# Altium schematic sheet Power.SchDoc
size A4; SheetNumber: 5; SheetTotal: 5
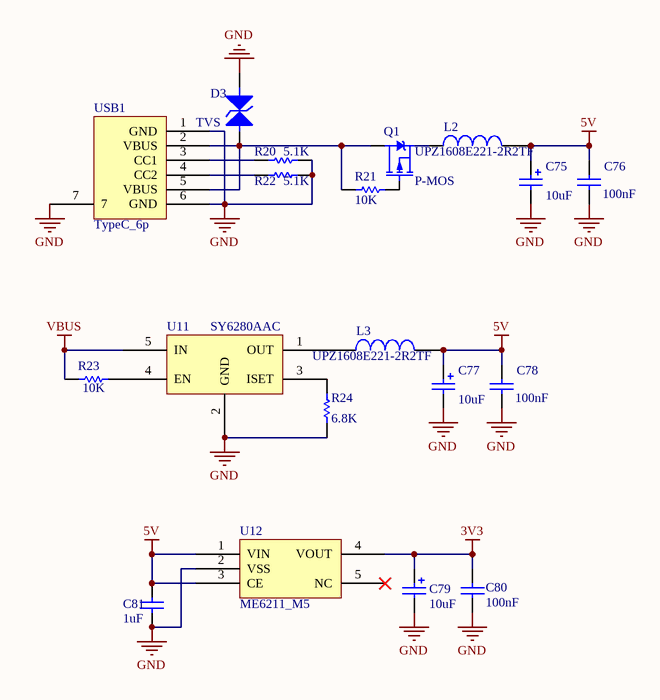
[diagram p0: Power.SchDoc]

## Parts
C75  value 10uF  [TAJ-A/3216]  (hidden comment: Cap Pol2)
C76  value 100nF  [C0603_M]  (hidden comment: Cap)
C77  value 10uF  [TAJ-A/3216]  (hidden comment: Cap Pol2)
C78  value 100nF  [C0603_M]  (hidden comment: Cap)
C79  value 10uF  [TAJ-A/3216]  (hidden comment: Cap Pol2)
C80  value 100nF  [C0603_M]  (hidden comment: Cap)
C81  value 1uF  [C0603_M]  (hidden comment: Cap)
D3  TVS  [SOD-123]
L2  UPZ1608E221-2R2TF  [0603L]
L3  UPZ1608E221-2R2TF  [0603L]
Q1  P-MOS  [SOT23]
R20  value 5.1K  [R0603_M]  (hidden comment: Res1)
R21  value 10K  [R0603_M]  (hidden comment: Res1)
R22  value 5.1K  [R0603_M]  (hidden comment: Res1)
R23  value 10K  [R0603_M]  (hidden comment: Res1)
R24  value 6.8K  [R0603_M]  (hidden comment: Res1)
U11  SY6280AAC  [SOT-23-5]
U12  ME6211_M5  [SOT-23-5]
USB1  TypeC_6p  [USB-C-SMD_6P]

## Nets
3V3: C79.1 C80.2 U12.4(VOUT)
5V: C75.1 C76.2 C77.1 C78.2 C81.2 L2.2 L3.2 U12.1(VIN) U12.3(CE)
GND: C75.2 C76.1 C77.2 C78.1 C79.2 C80.1 C81.1 D3.K R20.1 R22.1 R24.2 U11.2(GND) U12.2(VSS) USB1.1(GND) USB1.6(GND) USB1.7
VBUS: R23.2 U11.5(IN)
NetD3_A: D3.A Q1.D R21.1 USB1.2(VBUS) USB1.5(VBUS)
NetL2_1: L2.1 Q1.S
NetL3_1: L3.1 U11.1(OUT)
NetQ1_G: Q1.G R21.2
NetR20_2: R20.2 USB1.3(CC1)
NetR22_2: R22.2 USB1.4(CC2)
NetR23_1: R23.1 U11.4(EN)
NetR24_1: R24.1 U11.3(ISET)

Not connected (* = marked no-connect by the designer): U12 5(NC)*

## Library data of the parts
C75 C77 C79 = Cap Pol2: Polarized Capacitor (Axial); Published: 8-Jun-2000; LatestRevisionDate: 17-Jul-2002; LatestRevisionNote: Re-released for DXP Platform.; PackageReference: POLAR0.8; Publisher: Altium Limited; PackageDescription: Polarized Capacitor; 2 Leads
C76 C78 C80 C81 = Cap: Capacitor; Published: 8-Jun-2000; LatestRevisionDate: 17-Jul-2002; LatestRevisionNote: Re-released for DXP Platform.; PackageReference: RAD-0.3; Publisher: Altium Limited; PackageDescription: Radial Cap, Thru-Hole; 2 Leads; 0.3 in Pin Spacing
D3 = TVS: 双向瞬态抑制二极管
L2 L3 = INDUCTOR
Q1 = P-MOS: P沟道场效应管
R20-R24 = Res1: Resistor; Published: 8-Jun-2000; LatestRevisionDate: 17-Jul-2002; LatestRevisionNote: Re-released for DXP Platform.; PackageReference: AXIAL-0.3; Publisher: Altium Limited; PackageDescription: Axial Device, Thru-Hole; 2 Leads; 0.3 in Pin Spacing